# EAGLE schematic Source dc voltage and dc current_block (EAGLE 9.6.2)
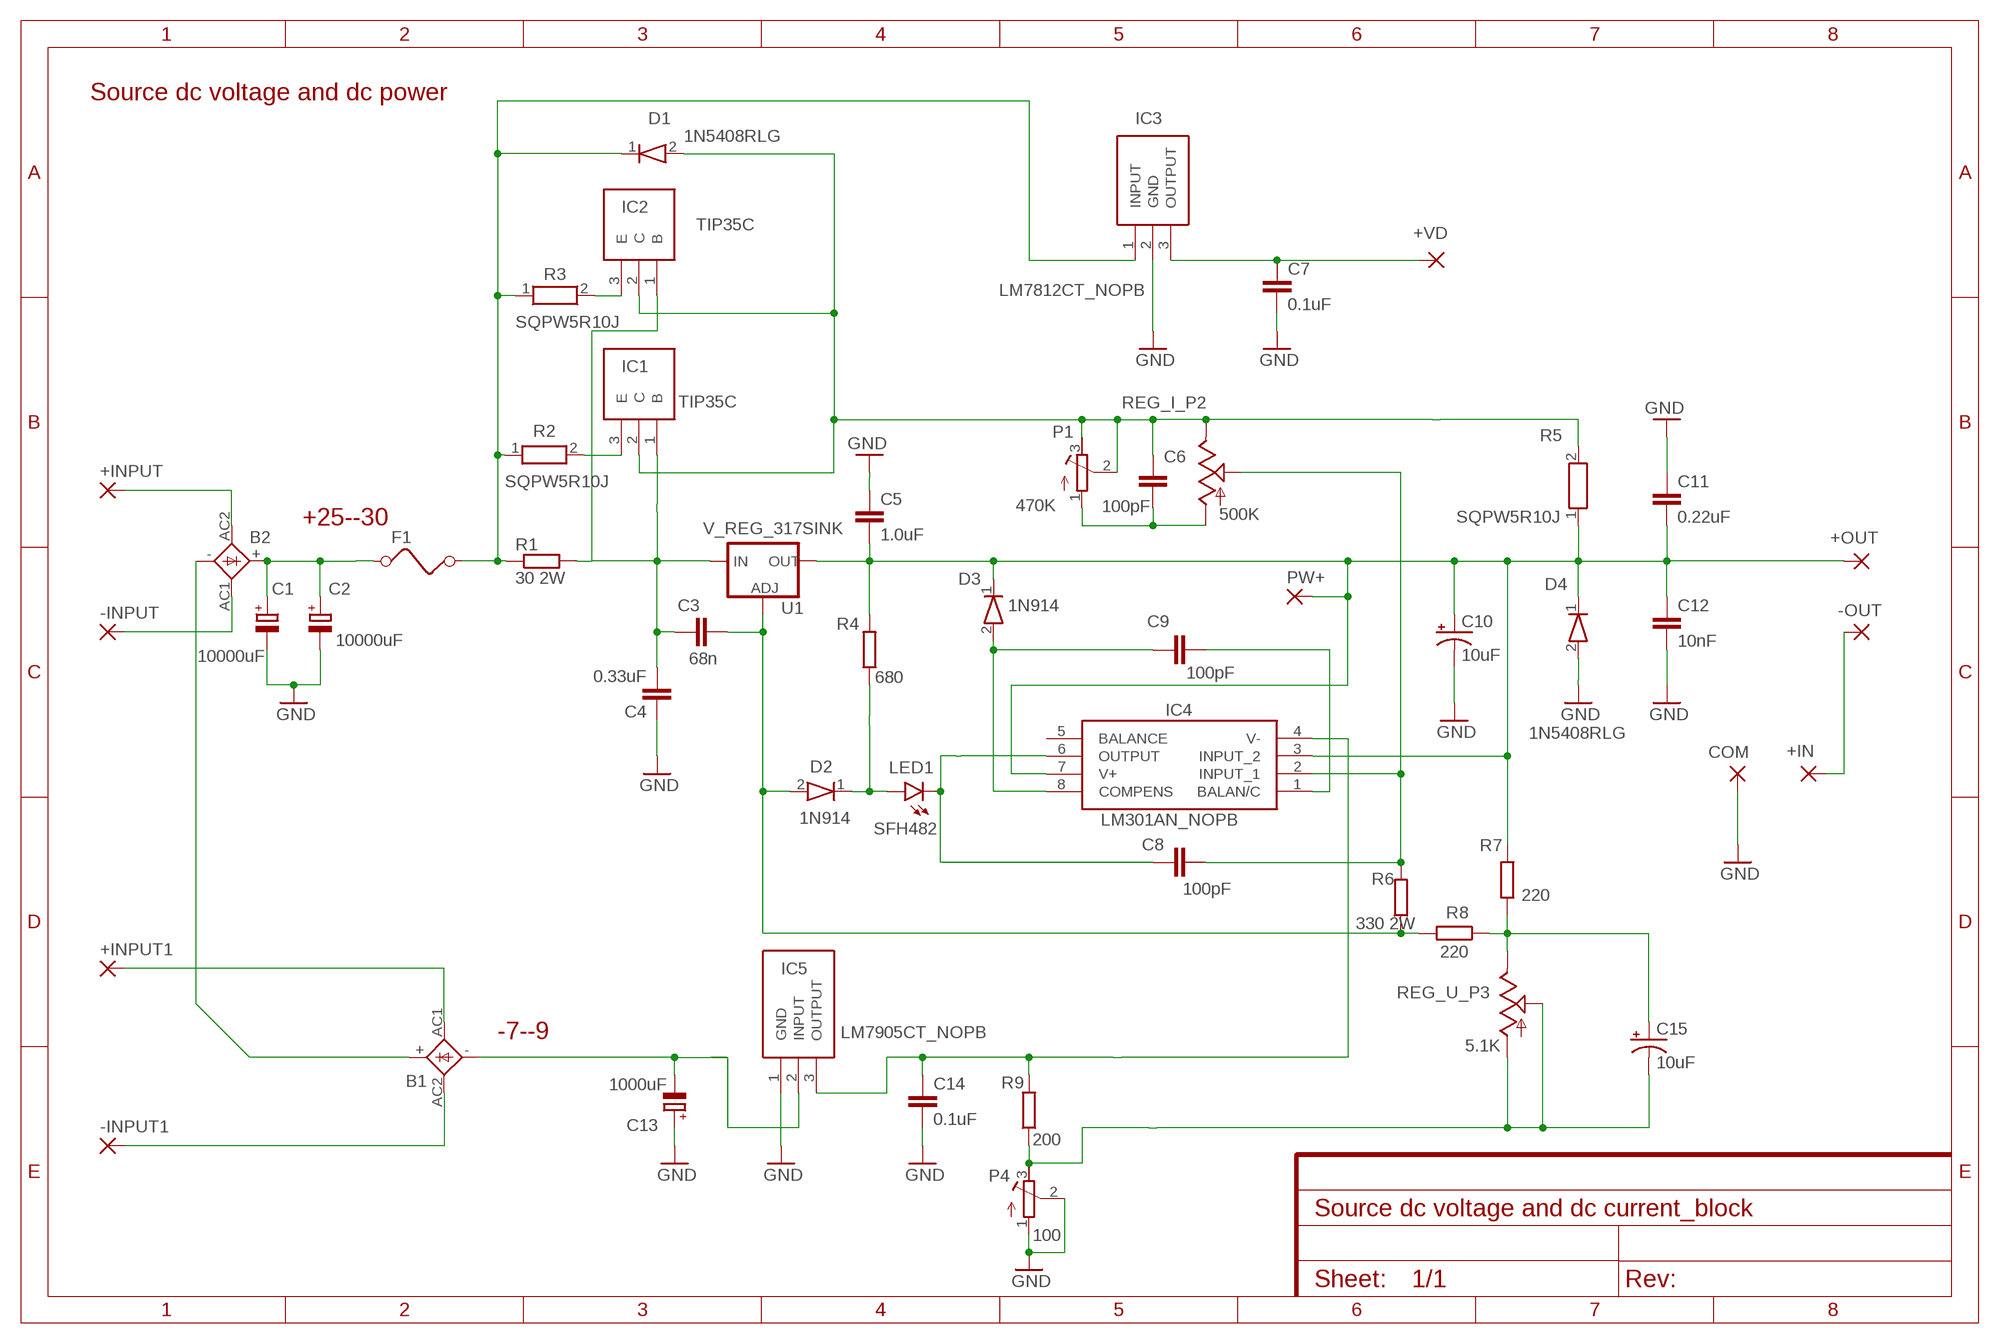
[diagram p0: schematic, sheet 1]

## Parts
+IN  3,17/1,3  [3,17/1,3]
+INPUT  3,17/1,3  [3,17/1,3]
+INPUT1  3,17/1,3  [3,17/1,3]
+OUT  3,17/1,3  [3,17/1,3]
+VD  3,81/1,4  [3,81/1,4]
-INPUT  3,17/1,3  [3,17/1,3]
-INPUT1  3,17/1,3  [3,17/1,3]
-OUT  3,17/1,3  [3,17/1,3]
B1  FBU4  [FBU4]
B2  FBU4  [FBU4]
C1  10000uF  CPOL-EUE10-30  [EB30D]
C2  10000uF  CPOL-EUE10-30  [EB30D]
C3  68n  C-EU050-025X075  [C050-025X075]
C4  0.33uF  C5/2.5  [C5B2.5]
C5  1.0uF  C-EU050-025X075  [C050-025X075]
C6  100pF  C5/2.5  [C5B2.5]
C7  0.1uF  C5/2.5  [C5B2.5]
C8  100pF  C5/2.5  [C5B2.5]
C9  100pF  C5/2.5  [C5B2.5]
C10  10uF  10UF-POLAR-RADIAL-2.5MM-25V-20%  [CPOL-RADIAL-2.5MM-5MM]
C11  0.22uF  C5/2.5  [C5B2.5]
C12  10nF  C5/2.5  [C5B2.5]
C13  1000uF  CPOL-EUE10-22.5  [EB22,5D]
C14  0.1uF  C5/2.5  [C5B2.5]
C15  10uF  10UF-POLAR-RADIAL-2.5MM-25V-20%  [CPOL-RADIAL-2.5MM-5MM]
COM  3,17/1,3  [3,17/1,3]
D1  1N5408RLG  [DIOAD2860W130L840D505]
D2  1N914  [DIOAD1068W53L380D172]
D3  1N914  [DIOAD1068W53L380D172]
D4  1N5408RLG  [DIOAD2860W130L840D505]
F1  FUSE  [FUSE]
IC1  TIP35C  [TO545P515X1560X2445-3P]
IC2  TIP35C  [TO545P515X1560X2445-3P]
IC3  LM7812CT_NOPB  [TO254P470X1028X1955-3P]
IC4  LM301AN_NOPB  [DIP794W53P254L959H508Q8N]
IC5  LM7905CT_NOPB  [TO254P470X1028X1955-3P]
LED1  SFH482  [SFH482]
P1  470K  R-TRIMM3296W  [RTRIM3296W]
P4  100  R-TRIMM3296W  [RTRIM3296W]
PW+  3,17/1,3  [3,17/1,3]
R1  30 2W  R-EU_0207/10  [0207/10]
R2  SQPW5R10J  [RESAD6200W85L2200D1000]
R3  SQPW5R10J  [RESAD6200W85L2200D1000]
R4  680  R-EU_R1206  [R1206]
R5  SQPW5R10J  [RESAD6200W85L2200D1000]
R6  330 2W  R-EU_0207/10  [0207/10]
R7  220  R-EU_M1206  [M1206]
R8  220  R-EU_M1206  [M1206]
R9  200  R-EU_M1206  [M1206]
REG_I_P2  500K  POT-RV16AF-20  [POT_ALPHA_RV16AF-20]
REG_U_P3  5.1K  POT-RV16AF-20  [POT_ALPHA_RV16AF-20]
U1  V_REG_317SINK  [TO220-ADJ]

## Nets
12V: D1.1(K) F1.2 IC3.1(INPUT) R1.1 R2.1 R3.1
GND: C1.- C2.- C4.1 C5.1 C7.2 C10.2(-) C11.1 C12.2 C13.+ C14.2 COM.1(P) D4.2(A) IC3.2(GND) IC5.1(GND) P4.1(A) P4.2(S)
IN+: +OUT.1(P) C5.2 C10.1(+) C11.2 C12.1 D3.1(K) D4.1(K) IC4.3(INPUT_2) IC4.7(V+) PW+.1(P) R4.2 R5.1 R7.2 U1.OUT
IN-: C6.1 D1.2(A) IC1.2(C) IC2.2(C) P1.2(S) P1.3(E) R5.2 REG_I_P2.3(E)
N$1: B2.+ C1.+ C2.+ F1.1
N$2: +VD.1(P) C7.1 IC3.3(OUTPUT)
N$3: B1.- C13.- IC5.2(INPUT)
N$4: +IN.1(P) -OUT.1(P)
N$5: D2.1(K) LED1.A R4.1
N$6: IC1.3(E) R2.2
N$8: -INPUT.1(P) B2.AC1(AC2)
N$9: IC2.3(E) R3.2
N$11: C6.2 P1.1(A) REG_I_P2.1(A)
N$12: +INPUT.1(P) B2.AC2(AC1)
N$13: -INPUT1.1(P) B1.AC2(AC1)
N$14: +INPUT1.1(P) B1.AC1(AC2)
N$16: C15.1(+) R7.1 R8.1 REG_U_P3.3(E)
N$20: C3.1 C4.2 IC1.1(B) IC2.1(B) R1.2 U1.IN
N$25: C8.1 IC4.6(OUTPUT) LED1.K(C)
N$26: B1.+ B2.-
N$28: C15.2(-) P4.3(E) R9.1 REG_U_P3.1(A) REG_U_P3.2(S)
N$39: C9.1 D3.2(A) IC4.8(COMPENS)
N$40: C9.2 IC4.1(BALAN/C)
N$41: C8.2 IC4.2(INPUT_1) R6.2 REG_I_P2.2(S)
OUT: C3.2 D2.2(A) R6.1 R8.2 U1.ADJ
VE: C14.1 IC4.4(V-) IC5.3(OUTPUT) R9.2
Unconnected: IC4.5(BALANCE)

## Notes on the sheet
- Source dc voltage and dc power
- R2
- +25--30
- -7--9

## Library data of the parts
+IN +INPUT +INPUT1 +OUT -INPUT -INPUT1 -OUT COM PW+ = wirepad:3,17/1,3: THROUGH-HOLE PAD
+VD = wirepad:3,81/1,4: THROUGH-HOLE PAD
B1 B2 = rectifier:FBU4: FAGOR RECTIFIER grid 3 x 5 mm
C1 C2 C13 = rcl:CPOL-EU: POLARIZED CAPACITOR, European symbol; SPICEPREFIX: C
C3 C5 = rcl:C-EU: CAPACITOR, European symbol; SPICEPREFIX: C
C4 C6-C9 C11 C12 C14 = capacitor-wima:C: CAPACITOR naming: grid - package width
C10 C15 = SparkFun-Capacitors:10UF-POLAR: 10.0µF polarized capacitors A capacitor is a passive two-terminal electrical component used to store electrical energy temporarily in an electric field.; PROD_ID: CAP-08440
D1 D4 = SamacSys_Parts:1N5408RLG: Source: Datasheet <http://www.onsemi.com/pub/Collateral/1N5400-D.PDF>; ARROW_PART_NUMBER: 1N5408RLG; ARROW_PRICE-STOCK: https://www.arrow.com/en/products/1n5408rlg/on-semiconductor; HEIGHT: mm; MANUFACTURER_NAME: ON Semiconductor; MANUFACTURER_PART_NUMBER: 1N5408RLG; MOUSER_PART_NUMBER: 863-1N5408RLG; MOUSER_PRICE-STOCK: https://www.mouser.co.uk/ProductDetail/ON-Semiconductor/1N5408RLG?qs=y2kkmE52mdN24wKCVTkxVw%3D%3D
D2 D3 = SamacSys_Parts:1N914: Small Signal Diode Source: Datasheet <https://www.onsemi.com/pub/Collateral/1N914-D.PDF>; ARROW_PART_NUMBER: 1N914; ARROW_PRICE-STOCK: https://www.arrow.com/en/products/1n914/on-semiconductor; DESCRIPTION: Small Signal Diode; HEIGHT: mm; MANUFACTURER_NAME: ON Semiconductor; MANUFACTURER_PART_NUMBER: 1N914; MOUSER_PART_NUMBER: 512-1N914; MOUSER_PRICE-STOCK: https://www.mouser.co.uk/ProductDetail/ON-Semiconductor-Fairchild/1N914?qs=NSEUUqpg2uCfNuQFcxVZsA%3D%3D
F1 = special:FUSE: FUSE 5 x 20 mm
IC1 IC2 = SamacSys_Parts:TIP35C: TIP35C, NPN Bipolar Transistor, 25 A 100 V HFE:10 3 MHz Power, 3-Pin TO-247 Source: Datasheet <http://www.st.com/web/en/resource/technical/document/datasheet/CD00001165.pdf>; ARROW_PART_NUMBER: TIP35C; ARROW_PRICE-STOCK: https://www.arrow.com/en/products/tip35c/stmicroelectronics; DESCRIPTION: TIP35C, NPN Bipolar Transistor, 25 A 100 V HFE:10 3 MHz Power, 3-Pin TO-247; HEIGHT: 5.15mm; MANUFACTURER_NAME: STMicroelectronics; MANUFACTURER_PART_NUMBER: TIP35C; MOUSER_PART_NUMBER: 511-TIP35C; MOUSER_PRICE-STOCK: https://www.mouser.co.uk/ProductDetail/STMicroelectronics/TIP35C?qs=ljbEvF4DwOMWoKR%2FCFhSgA%3D%3D
IC3 = SamacSys_Parts:LM7812CT_NOPB: Texas Instruments LM7812CT/NOPB Positive Voltage Regulator, 1A, 12 V 3-Pin, TO-220 Source: Datasheet <http://www.ti.com/lit/ds/symlink/lm340.pdf>; ARROW_PART_NUMBER: LM7812CT/NOPB; ARROW_PRICE-STOCK: https://www.arrow.com/en/products/lm7812ctnopb/texas-instruments; DESCRIPTION: Texas Instruments LM7812CT/NOPB Positive Voltage Regulator, 1A, 12 V 3-Pin, TO-220; HEIGHT: 4.7mm; MANUFACTURER_NAME: Texas Instruments; MANUFACTURER_PART_NUMBER: LM7812CT/NOPB; MOUSER_PART_NUMBER: 926-LM7812CT/NOPB; MOUSER_PRICE-STOCK: https://www.mouser.co.uk/ProductDetail/Texas-Instruments/LM7812CT-NOPB?qs=OYMYEaN9QmBofCpFKHiRuQ%3D%3D
IC4 = SamacSys_Parts:LM301AN_NOPB: Texas Instruments LM301AN/NOPB Op Amp, 8-Pin MDIP Source: Datasheet <http://www.ti.com/lit/gpn/lm301a-n>; ARROW_PART_NUMBER: LM301AN/NOPB; ARROW_PRICE-STOCK: https://www.arrow.com/en/products/lm301annopb/texas-instruments; DESCRIPTION: Texas Instruments LM301AN/NOPB Op Amp, 8-Pin MDIP; HEIGHT: 5.08mm; MANUFACTURER_NAME: Texas Instruments; MANUFACTURER_PART_NUMBER: LM301AN/NOPB; MOUSER_PART_NUMBER: 926-LM301AN/NOPB; MOUSER_PRICE-STOCK: https://www.mouser.com/Search/Refine.aspx?Keyword=926-LM301AN%2FNOPB
IC5 = SamacSys_Parts:LM7905CT_NOPB: Voltage regulator,LM7905CT -5V Texas Instruments LM7905CT/NOPB, Single Negative Voltage Regulator 1.5A -5 V, +/-4%, 3-Pin TO-220 Source: Datasheet <http://www.ti.com/lit/gpn/lm7905>; ARROW_PART_NUMBER: LM7905CT/NOPB; ARROW_PRICE-STOCK: https://www.arrow.com/en/products/lm7905ctnopb/texas-instruments; DESCRIPTION: Voltage regulator,LM7905CT -5V Texas Instruments LM7905CT/NOPB, Single Negative Voltage Regulator 1.5A -5 V, +/-4%, 3-Pin TO-220; HEIGHT: 4.7mm; MANUFACTURER_NAME: Texas Instruments; MANUFACTURER_PART_NUMBER: LM7905CT/NOPB; MOUSER_PART_NUMBER: 926-LM7905CT/NOPB; MOUSER_PRICE-STOCK: https://www.mouser.co.uk/ProductDetail/Texas-Instruments/LM7905CT-NOPB?qs=QbsRYf82W3EUyxHaqeuxKA%3D%3D
LED1 = led:SFH482: IR LED infrared emitting diode, Infineon
P1 P4 = rcl:R-TRIMM: Trimm resistor; SPICEMODEL: X; SPICEPREFIXL: POT
R1 R4 R6-R9 = rcl:R-EU_: RESISTOR, European symbol; SPICEPREFIX: R
R2 R3 R5 = SamacSys_Parts:SQPW5R10J: Wirewound Resistors - Through Hole SQP5 R10 5% WIRE Source: Datasheet <https://componentsearchengine.com/Datasheets/2/SQPW5R10J.pdf>; ARROW_PART_NUMBER: SQPW5R10J; ARROW_PRICE-STOCK: https://www.arrow.com/en/products/sqpw5r10j/te-connectivity; DESCRIPTION: Wirewound Resistors - Through Hole SQP5 R10 5% WIRE; HEIGHT: mm; MANUFACTURER_NAME: TE Connectivity; MANUFACTURER_PART_NUMBER: SQPW5R10J; MOUSER_PART_NUMBER: 279-SQPW5R10J; MOUSER_PRICE-STOCK: https://www.mouser.co.uk/ProductDetail/TE-Connectivity-Holsworthy/SQPW5R10J?qs=iJVBkmKXgrl0xB%2F8rZ4PHw%3D%3D
REG_I_P2 REG_U_P3 = SparkFun-Electromechanical:POT
U1 = SparkFun-IC-Power:V_REG_317: Voltage Regulator Standard LM317 adjustable voltage regulator. AOI (Adjust Output Input). Google 'LM317 Calculator' for easy to use app to get the two resistor values needed. 240/720 for 5V output. 240/390 for 3.3V output. Spark Fun Electronics SKU : COM-00527